# EAGLE design atommc-extender (EAGLE 9.6.1)
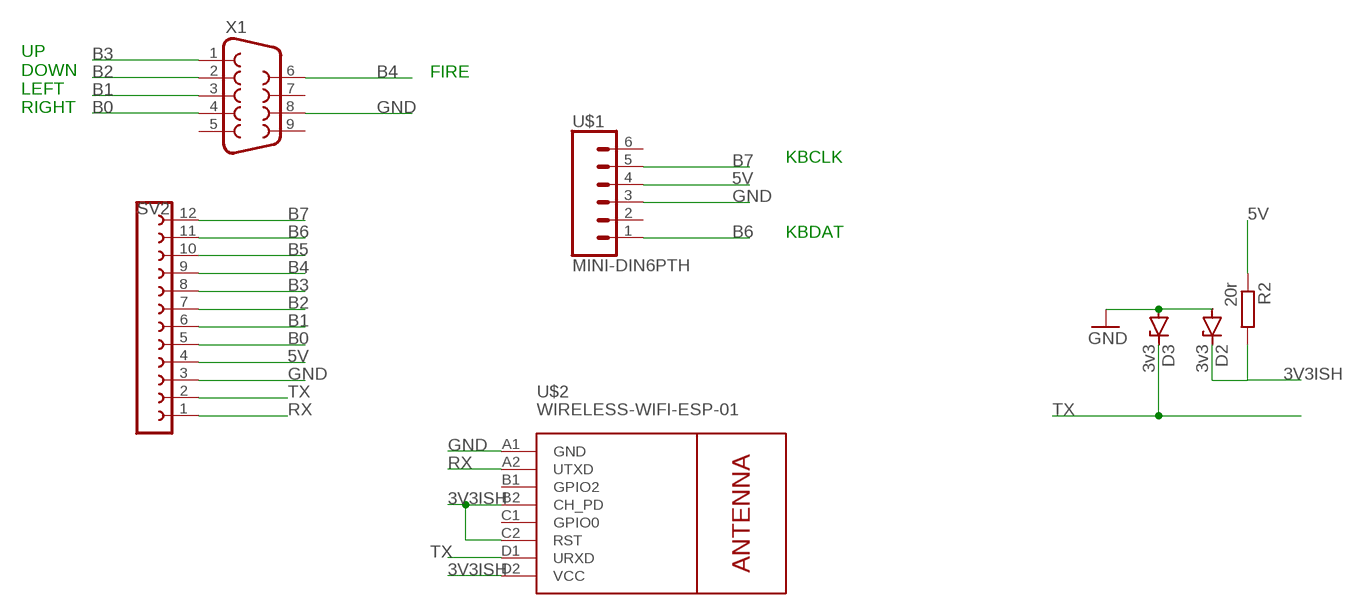
[diagram p0: schematic, sheet 1]

## Parts
D2  3v3  ZENER-DIODEDO34-7  [DO34Z7]
D3  3v3  ZENER-DIODEDO34-7  [DO34Z7]
R2  20r  R-EU_0207/10  [0207/10]
SV2  FE12-1  [FE12]
U$1  MINI-DIN6PTH  [MINI-DIN6]
U$2  WIRELESS-WIFI-ESP-01  [WIRELESS-WIFI-ESP-01]
X1  F09V  [F09V]

## Nets
3V3ISH: D2.C R2.2 U$2.B2(CH_PD) U$2.C2(RST) U$2.D2(VCC)
5V: R2.1 SV2.4 U$1.4
B0: SV2.5 X1.4
B1: SV2.6 X1.3
B2: SV2.7 X1.2
B3: SV2.8 X1.1
B4: SV2.9 X1.6
B5: SV2.10
B6: SV2.11 U$1.1
B7: SV2.12 U$1.5
GND: D2.A D3.A SV2.3 U$1.3 U$2.A1(GND) X1.8
RX: SV2.1 U$2.A2(UTXD)
TX: D3.C SV2.2 U$2.D1(URXD)
Unconnected: U$1.2 U$1.6 U$2.B1(GPIO2) U$2.C1(GPIO0) X1.5 X1.7 X1.9

## Notes on the sheet
- FIRE
- UP
  DOWN
  LEFT
  RIGHT
- KBCLK
  
  
  
  KBDAT

## Library data of the parts
D2 D3 = diode:ZENER-DIODE: Z-Diode
R2 = rcl:R-EU_: RESISTOR, European symbol; SPICEPREFIX: R
SV2 = con-lsta:FE12-1: FEMALE HEADER; OC_FARNELL: unknown; OC_NEWARK: unknown
U$1 = SparkFun-Retired:MINI-DIN6: Mini DIN 6 Connector SparkFun used to sell this connector and has used it on a couple designs, however the connector and the designs are now retired. Mini DIN 6 Connector [RETIRED] <https://www.sparkfun.com/products/retired/8509> SparkFun Key Counter - PS2 [RETIRED] <https://www.sparkfun.com/products/retired/8652> Commonly found on the back of a computer for PS2 keyboard and mice. Schematic and footprint are proven.
U$2 = diy-modules:WIRELESS-WIFI-ESP-01: Wireless Wi-Fi ESP-01 Module based on ESP8266 chip Click here to find device on ebay.com <http://www.ebay.com/sch/esp8266+esp+01+transceiver>
X1 = con-subd:F09: SUB-D; OC_FARNELL: unknown; OC_NEWARK: unknown

## Board
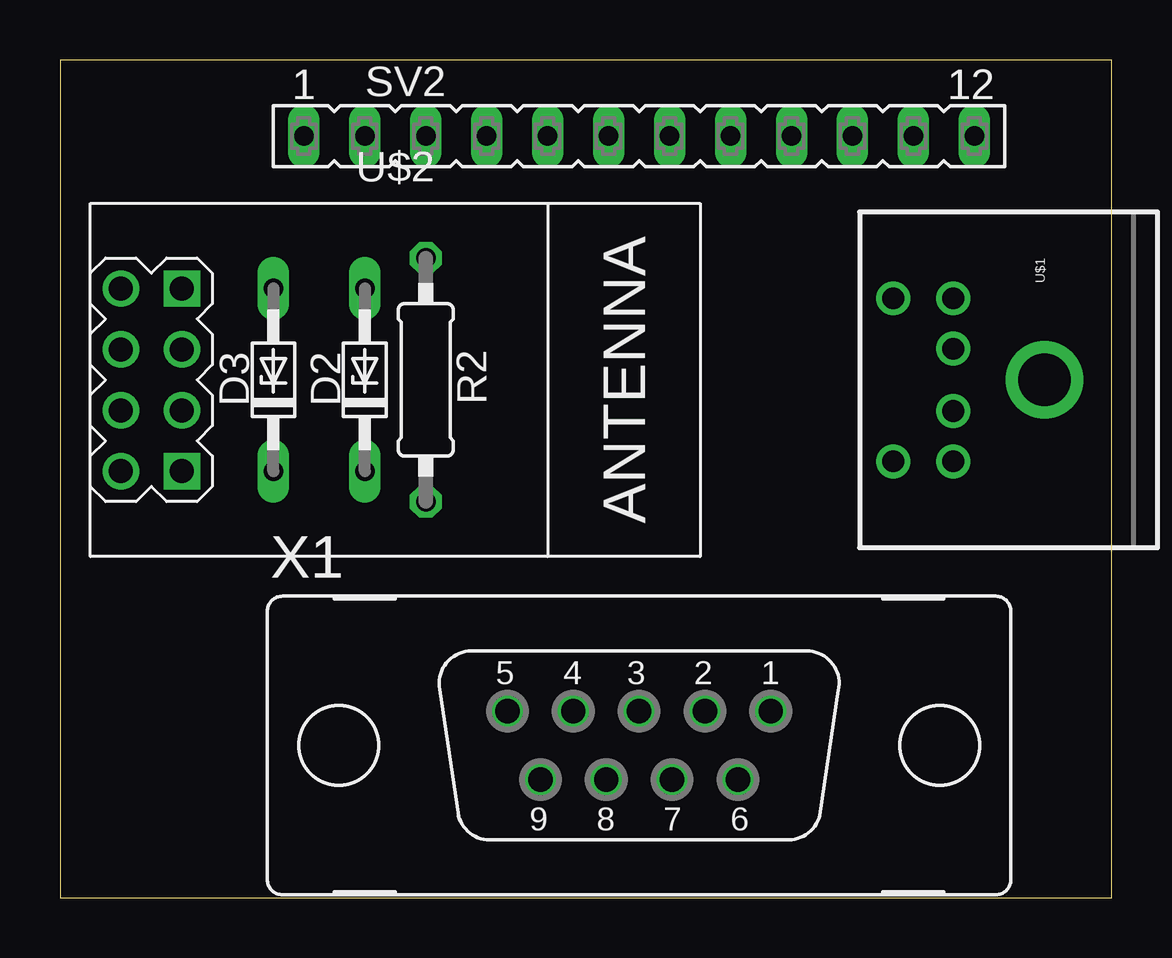
[diagram p1: board, top side]
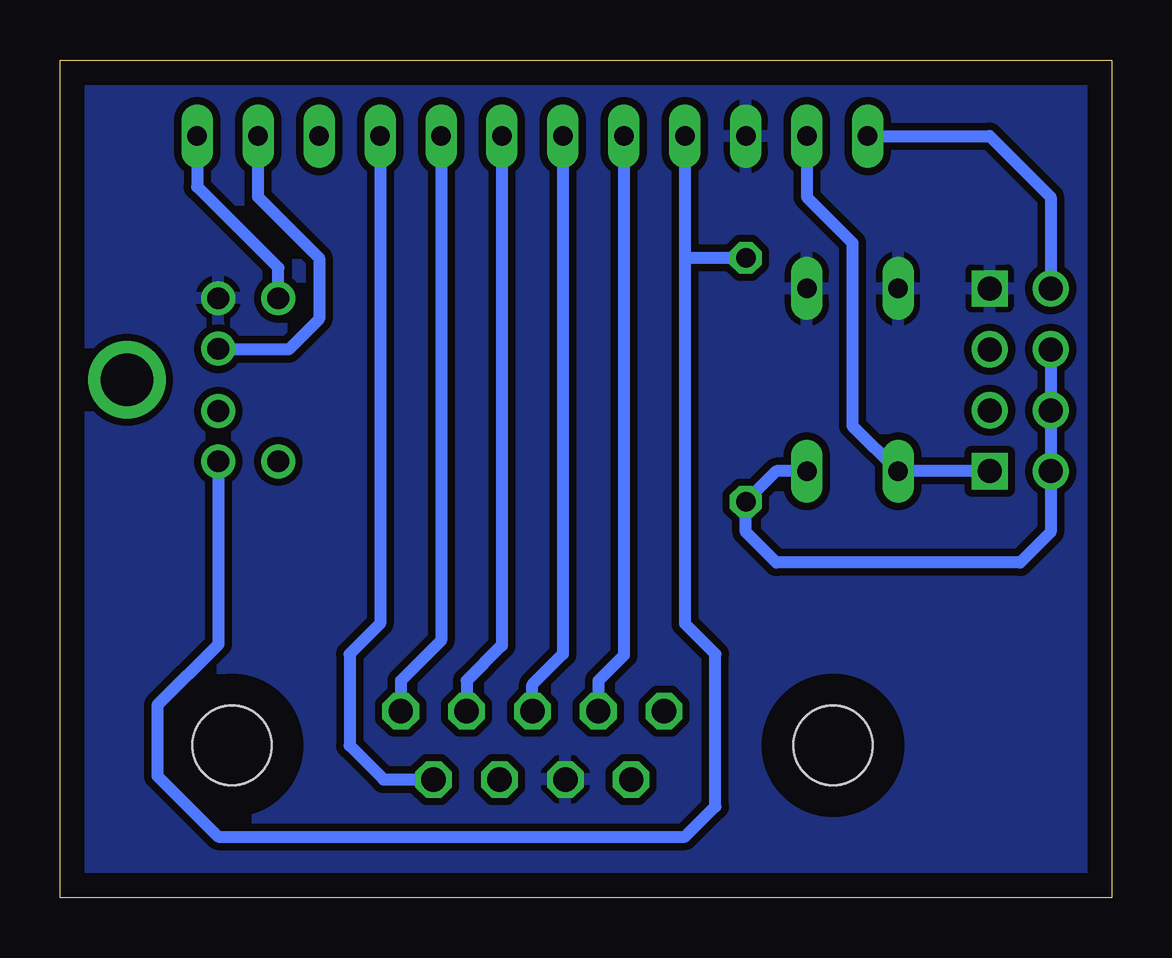
[diagram p2: board, bottom side, seen from below]

Size 43.81 x 34.92 mm. Coordinates in mm from the lower left corner, seen from the top.
Outline: 0,0 43.81,0 43.81,34.92 0,34.92 0,0
Copper layers (1*16): Top 0.035mm / dielectric 1.5mm / Bottom 0.035mm
Design rules "default": minimum track width 6mil, minimum drill 0.35mm, track to track 6mil, track to pad 6mil, pad to pad 6mil, via to via 6mil, smd to smd 6mil, copper to edge 40mil, drill to drill 6mil, minimum pad ring 10mil, minimum via ring 8mil, stop-mask expansion 4mil, vias tented up to drill 0mil, thermal gap 10mil

### Footprints (pad centres in the part's own frame; a part is rotated, then mirrored left to right if it is on the bottom)
DO34Z7 = drill 0.813 long: A 3.81,0; C -3.81,0
0207/10 = drill 0.813 octagon: 1 -5.08,0; 2 5.08,0
FE12 = drill 0.813 long: 1 -13.97,0; 2 -11.43,0; 3 -8.89,0; 4 -6.35,0; 5 -3.81,0; 6 -1.27,0; 7 1.27,0; 8 3.81,0; 9 6.35,0; 10 8.89,0; 11 11.43,0; 12 13.97,0
MINI-DIN6 = drill 0.9: 1 -1.3,-8.5; 2 1.3,-8.5; 3 -3.4,-8.5; 4 3.4,-8.5; 5 -3.4,-11; 6 3.4,-11 | drill 2.2: P$1 0,-4.7
WIRELESS-WIFI-ESP-01 = drill 1 square: A1 -8.89,3.81; D1 -8.89,-3.81 | drill 1: A2 -11.43,3.81; B1 -8.89,1.27; B2 -11.43,1.27; C1 -8.89,-1.27; C2 -11.43,-1.27; D2 -11.43,-3.81
F09V = drill 1.016 octagon: 1 5.486,1.422; 2 2.743,1.422; 3 0,1.422; 4 -2.743,1.422; 5 -5.486,1.422; 6 4.115,-1.422; 7 1.372,-1.422; 8 -1.372,-1.422; 9 -4.115,-1.422 | hole 3.302: -12.522,0; 12.522,0

### Placement (x,y rotation side)
D2  12.7,21.59 90 top
D3  8.89,21.59 90 top
R2  15.24,21.59 270 top
SV2  24.13,31.75 0 top
U$1  45.72,21.59 270 top
U$2  13.97,21.59 0 top
X1  24.13,6.35 0 top

### Tracks (layer width: path | path; a pad name or v marks a point on that pad's centre or on a via)
3V3ISH
  Bottom 0.508: U$2.B2 U$2.C2 U$2.D2 2.54,15.24 3.81,13.97 13.97,13.97 15.24,15.24 R2.2 13.97,17.78 D2.C
5V
  Bottom 0.508: U$1.4 37.22,10.57 39.76,8.03 39.76,5.08 37.22,2.54 17.78,2.54 16.51,3.81 16.51,10.16 17.78,11.43 17.78,26.67 | SV2.4 17.78,26.67 | R2.1 17.78,26.67
B0
  Bottom 0.508: X1.4 21.39,9.04 20.32,10.11 SV2.5
B1
  Bottom 0.508: SV2.6 22.86,10.16 24.13,8.89 X1.3
B2
  Bottom 0.508: X1.2 26.87,9.04 25.4,10.52 SV2.7
B3
  Bottom 0.508: X1.1 29.62,9.04 27.94,10.72 SV2.8
B4
  Bottom 0.508: X1.6 30.33,4.93 31.75,6.35 31.75,10.16 30.48,11.43 SV2.9
B6
  Bottom 0.508: U$1.1 37.19,22.86 34.29,22.86 33.02,24.13 33.02,26.67 35.56,29.21 SV2.11
B7
  Bottom 0.508: SV2.12 38.1,29.64 34.72,26.26 U$1.5
GND
  pour Bottom (isolate 0.305): 0,34.92 43.81,34.92 43.81,0 0,0
RX
  Bottom 0.508: SV2.1 5.08,31.75 2.54,29.21 U$2.A2
TX
  Bottom 0.508: SV2.2 12.7,29.21 10.8,27.31 10.8,19.69 D3.C U$2.D1